# EAGLE schematic lcdboard (EAGLE 9.4.2)
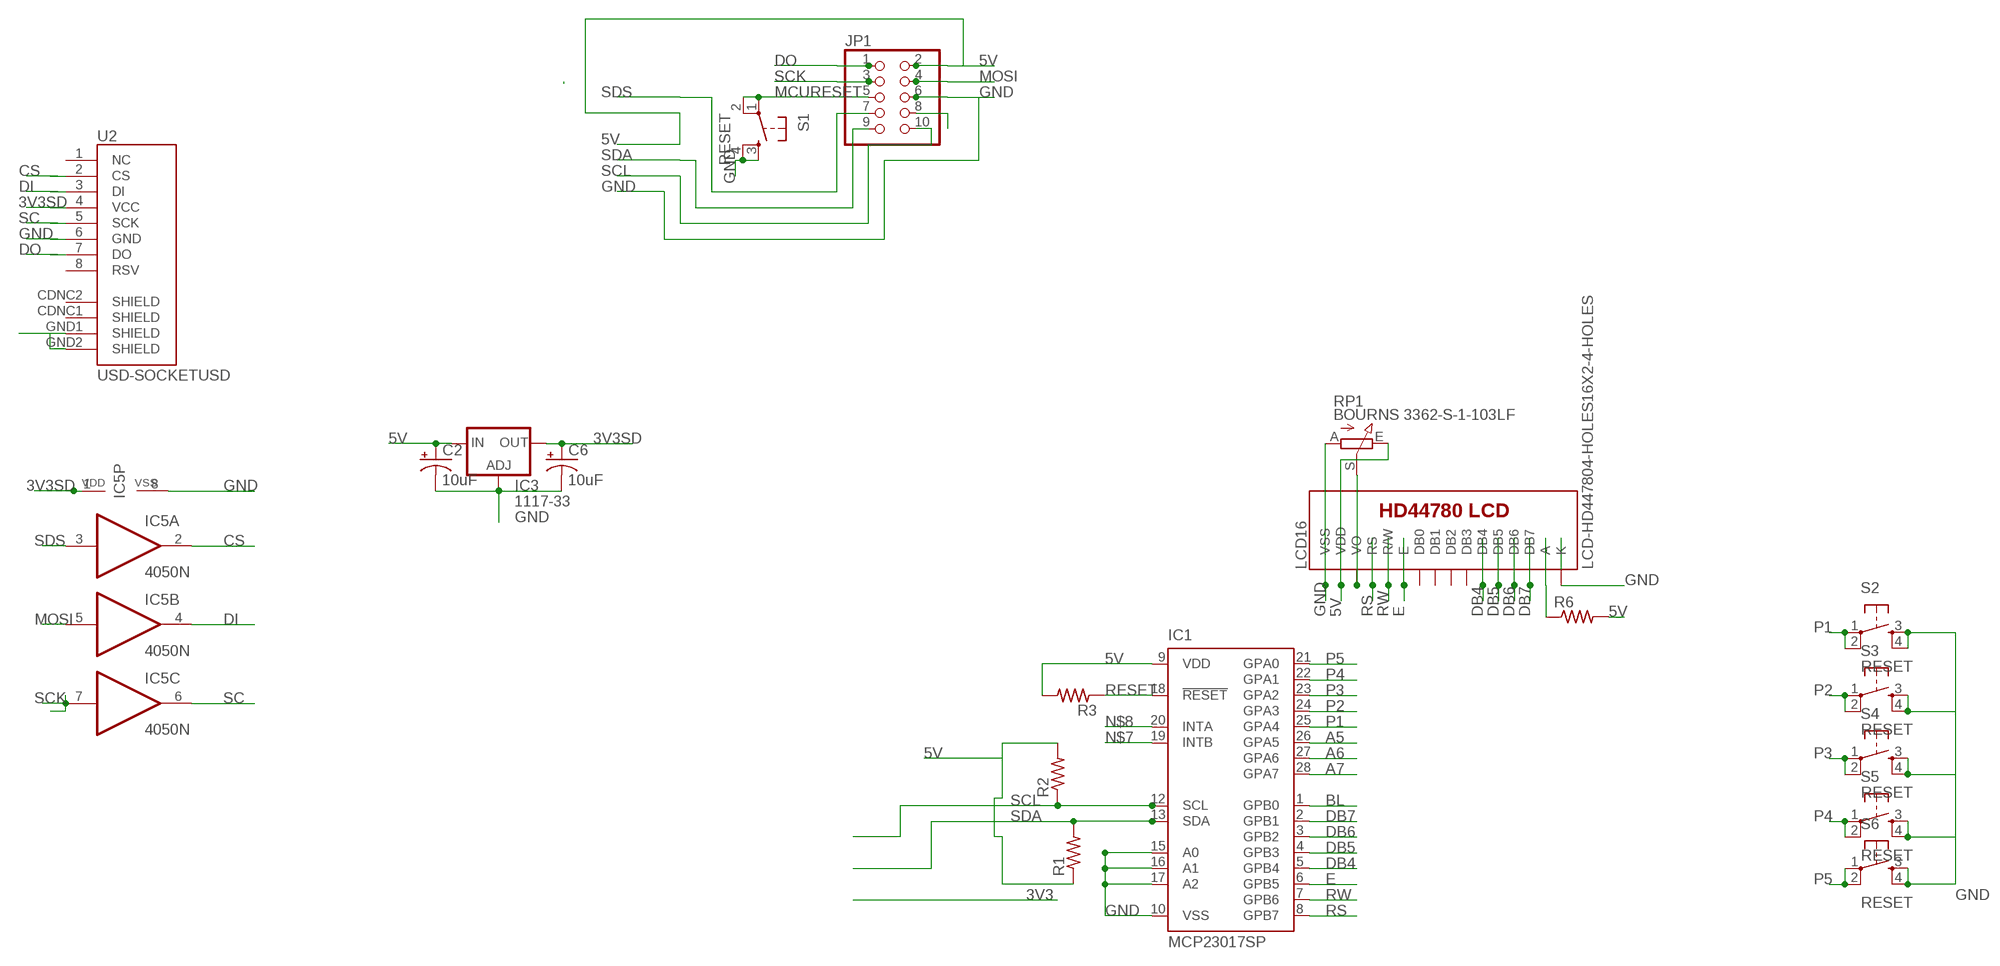
[diagram p0: schematic, sheet 1]

## Parts
C2  10uF  CAP_POL1206  [EIA3216]
C6  10uF  CAP_POL1206  [EIA3216]
IC1  MCP23017SP  [DIL28-3]
IC3  1117-33  LD117AS33TR  [SOT223]
IC5  4050N  [DIL16]
JP1  PINHD-2X5  [2X05]
LCD16  LCD-HD447804-HOLES16X2-4-HOLES  [LCD-16X2-4HOLES]
R1  R-US_0204/7  [0204/7]
R2  R-US_0204/7  [0204/7]
R3  R-US_0204/7  [0204/7]
R6  R-US_0204/7  [0204/7]
RP1  BOURNS 3362-S-1-103LF  POTVERTICAL  [POT_B64W]
S1  RESET  TAC_SWITCHPTH  [TACTILE-PTH]
S2  RESET  TAC_SWITCHPTH  [TACTILE-PTH]
S3  RESET  TAC_SWITCHPTH  [TACTILE-PTH]
S4  RESET  TAC_SWITCHPTH  [TACTILE-PTH]
S5  RESET  TAC_SWITCHPTH  [TACTILE-PTH]
S6  RESET  TAC_SWITCHPTH  [TACTILE-PTH]
U2  USD-SOCKETUSD  [USD-SOCKET-PP]

## Nets
3V3SD: C6.A(+) IC3.4(OUT) IC5.1(P:VDD) U2.4(VCC)
5V: C2.A(+) IC1.9(VDD) IC3.3(IN) JP1.2 LCD16.2(VDD) R1.1 R2.2 R3.2 R6.2 RP1.E
A5: IC1.26(GPA5)
A6: IC1.27(GPA6)
A7: IC1.28(GPA7)
BL: IC1.1(GPB0)
CS: IC5.2(A:O) U2.2(CS)
DB4: IC1.5(GPB4) LCD16.11(DB4)
DB5: IC1.4(GPB3) LCD16.12(DB5)
DB6: IC1.3(GPB2) LCD16.13(DB6)
DB7: IC1.2(GPB1) LCD16.14(DB7)
DI: IC5.4(B:O) U2.3(DI)
DO: JP1.1 U2.7(DO)
E: IC1.6(GPB5) LCD16.6(E)
GND: C2.C(-) C6.C(-) IC1.10(VSS) IC1.15(A0) IC1.16(A1) IC1.17(A2) IC3.1(ADJ) IC5.8(P:VSS) JP1.6 LCD16.1(VSS) LCD16.16(K) RP1.A S1.3 S1.4 S2.3 S2.4 S3.3 S3.4 S4.3 S4.4 S5.3 S5.4 S6.3 S6.4 U2.6(GND) U2.GND1(SHIELD) U2.GND2(SHIELD)
MCURESET: JP1.5 S1.1 S1.2
MOSI: IC5.5(B:I) JP1.4
N$1: LCD16.3(VO) RP1.S
N$2: LCD16.15(A) R6.1
N$3: JP1.8
N$7: IC1.19(INTB)
N$8: IC1.20(INTA)
P1: IC1.25(GPA4) S2.1 S2.2
P2: IC1.24(GPA3) S3.1 S3.2
P3: IC1.23(GPA2) S4.1 S4.2
P4: IC1.22(GPA1) S5.1 S5.2
P5: IC1.21(GPA0) S6.1 S6.2
RESET: IC1.18(!RESET) R3.1
RS: IC1.8(GPB7) LCD16.4(RS)
RW: IC1.7(GPB6) LCD16.5(R/W)
SC: IC5.6(C:O) U2.5(SCK)
SCK: IC5.7(C:I) JP1.3
SCL: IC1.12(SCL) JP1.10 R2.1
SDA: IC1.13(SDA) JP1.9 R1.2
SDS: IC5.3(A:I) JP1.7
Unconnected: IC5.9(D:I) IC5.10(D:O) IC5.11(E:I) IC5.12(E:O) IC5.14(F:I) IC5.15(F:O) LCD16.7(DB0) LCD16.8(DB1) LCD16.9(DB2) LCD16.10(DB3) U2.1(NC) U2.8(RSV) U2.CDNC1(SHIELD) U2.CDNC2(SHIELD)

## Library data of the parts
C2 C6 = SparkFun:CAP_POL: Capacitor Polarized These are standard SMD and PTH capacitors. Normally 10uF, 47uF, and 100uF in electrolytic and tantalum varieties. Always verify the external diameter of the through hole cap, it varies with capacity, voltage, and manufacturer. The EIA devices should be standard.
IC1 = adafruit:MCP23017: http://ww1.microchip.com/downloads/en/DeviceDoc/21952a.pdf Source: http://ww1.microchip.com/downloads/en/DeviceDoc/21952a.pdf
IC3 = v-reg:LD117A?*: Low drop fixed and adjustable positive voltage regulators 1 A Source: http://www.st.com/stonline/products/literature/ds/7194/ld1117axx.pdf
IC5 = 40xx:4050: Hex non-inverting BUFFER
JP1 = pinhead:PINHD-2X5: PIN HEADER
LCD16 = HD44780LCD:LCD-HD44780
R1-R3 R6 = adafruit:R-US_: RESISTOR, American symbol
RP1 = presetpot:POTVERTICAL
S1-S6 = SparkFun:TAC_SWITCH: Momentary Switch Button commonly used for reset or general input. Spark Fun Electronics SKU : COM-00097
U2 = SparkFun-Connectors_PETERMICROSDEBAY:USD-SOCKET: microSD Socket Push-push type uSD socket. Schematic element and footprint production proven. Spark Fun Electronics SKU : PRT-00127. tDoc lines correctly indicate media card edge positions when inserting (unlocked, locked, depressed).

## Net classes
0 default: width 0.254 mm, clearance 0.152 mm
1 power: clearance 0.152 mm